# EAGLE schematic c65Keyb (EAGLE 7.1.0)

## Sheet 1 of 2
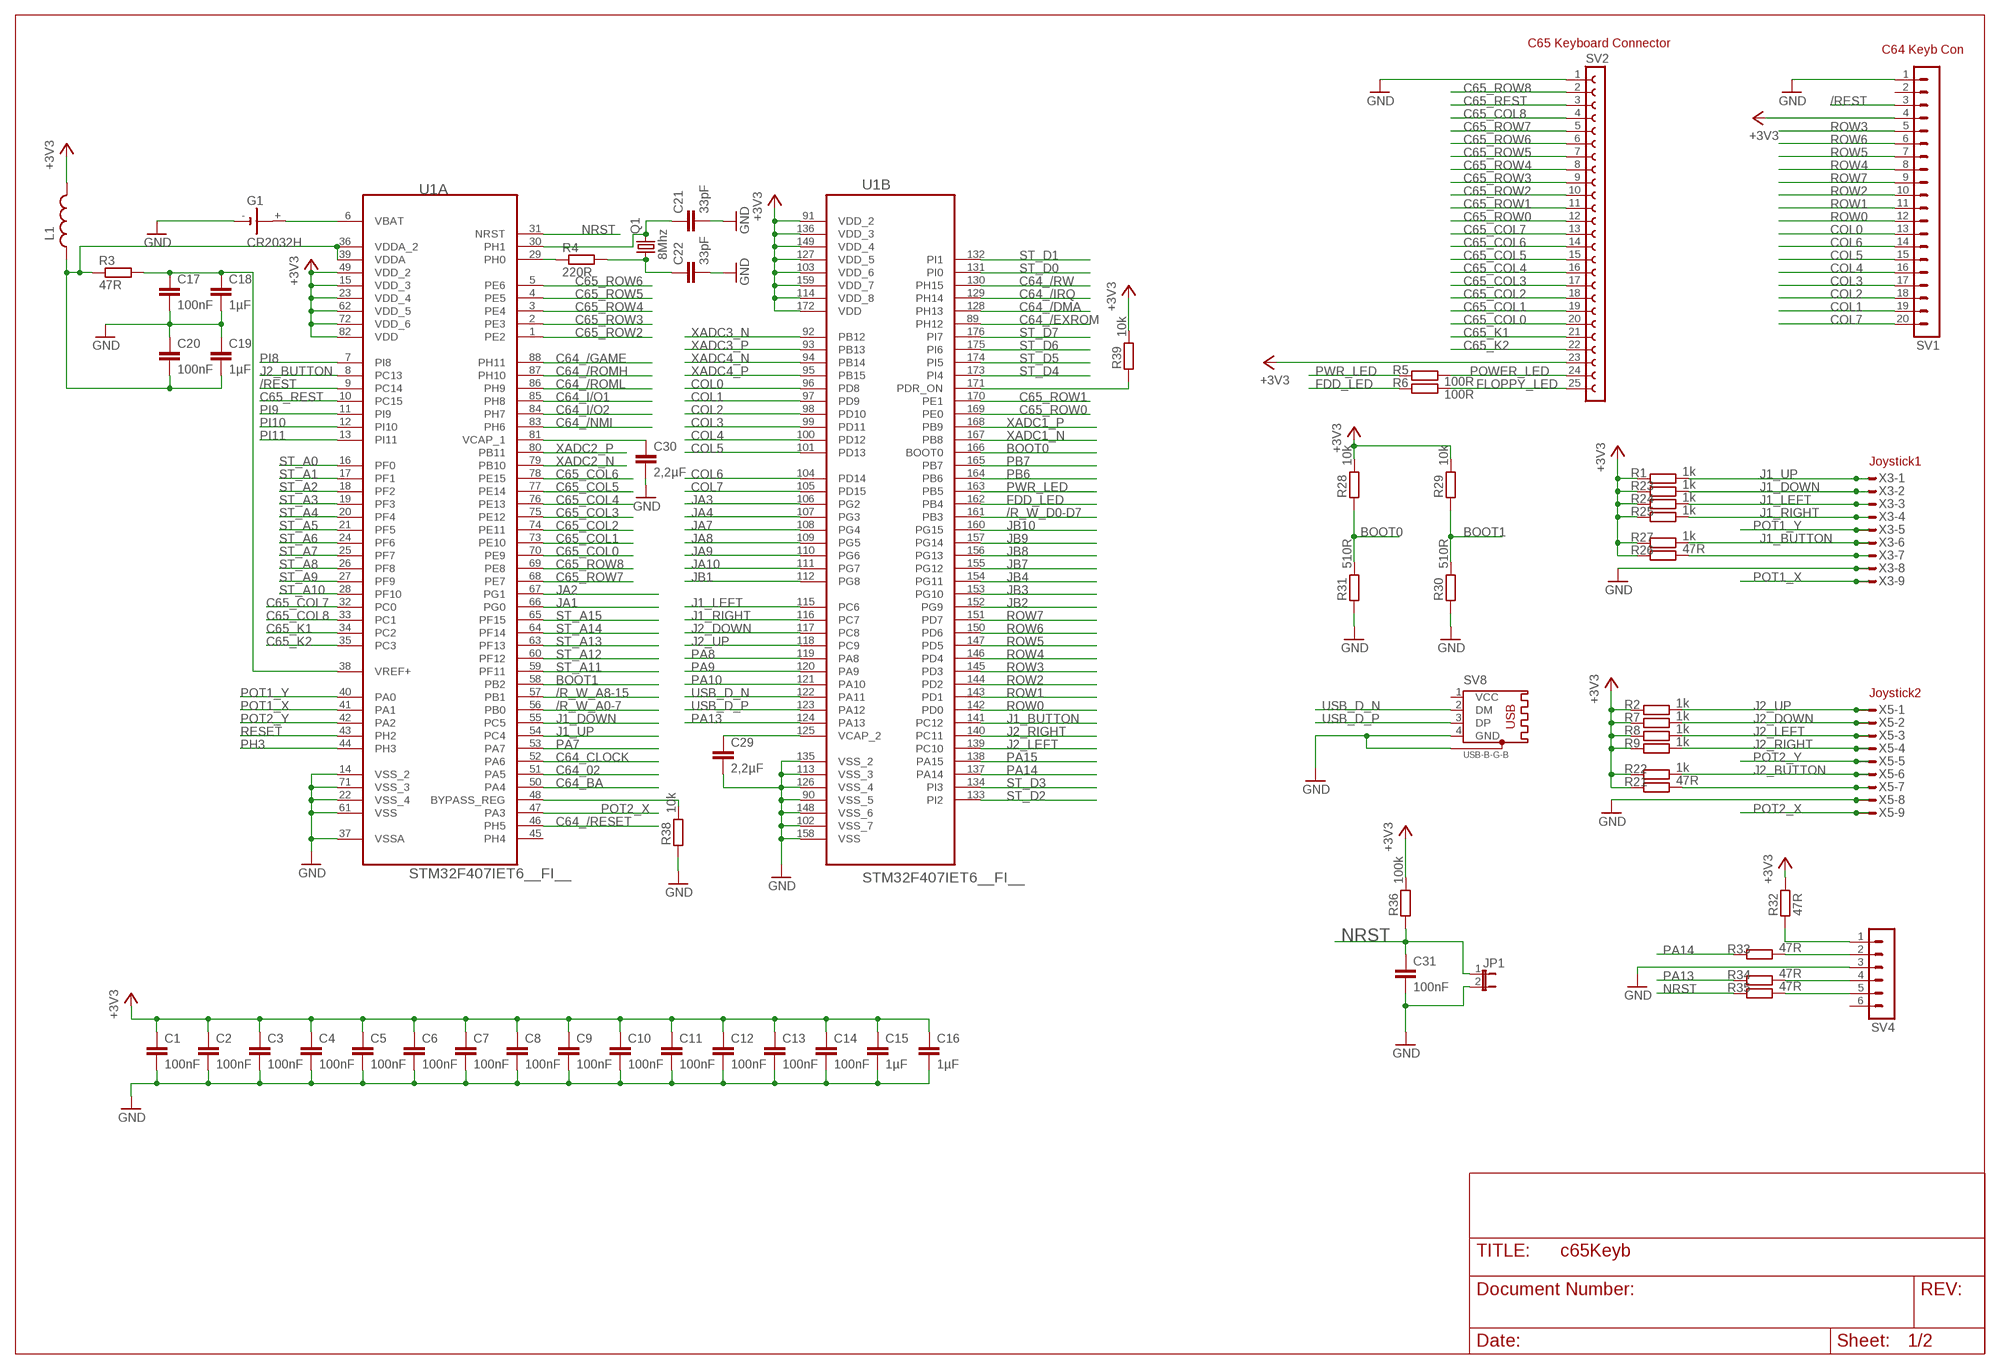
[diagram p0: schematic, sheet 1]

### Parts
C1  100nF  C-EUC0805  [C0805]
C2  100nF  C-EUC0805  [C0805]
C3  100nF  C-EUC0805  [C0805]
C4  100nF  C-EUC0805  [C0805]
C5  100nF  C-EUC0805  [C0805]
C6  100nF  C-EUC0805  [C0805]
C7  100nF  C-EUC0805  [C0805]
C8  100nF  C-EUC0805  [C0805]
C9  100nF  C-EUC0805  [C0805]
C10  100nF  C-EUC0805  [C0805]
C11  100nF  C-EUC0805  [C0805]
C12  100nF  C-EUC0805  [C0805]
C13  100nF  C-EUC0805  [C0805]
C14  100nF  C-EUC0805  [C0805]
C15  1µF  C-EUC0805  [C0805]
C16  1µF  C-EUC0805  [C0805]
C17  100nF  C-EUC0805  [C0805]
C18  1µF  C-EUC0805  [C0805]
C19  1µF  C-EUC0805  [C0805]
C20  100nF  C-EUC0805  [C0805]
C21  33pF  C-EUC0805  [C0805]
C22  33pF  C-EUC0805  [C0805]
C29  2,2µF  C-EUC0805  [C0805]
C30  2,2µF  C-EUC0805  [C0805]
C31  100nF  C-EUC0805  [C0805]
G1  CR2032H  [CR2032H]
JP1  JP1E  [JP1]
L1  L-0805A  [SMD0805-ALT]
Q1  8Mhz  CRYSTAL-HC49UP  [HC49UP]
R1  1k  R-EU_R0805  [R0805]
R2  1k  R-EU_R0805  [R0805]
R3  47R  R-EU_R0805  [R0805]
R4  220R  R-EU_R0805  [R0805]
R5  100R  R-EU_R0805  [R0805]
R6  100R  R-EU_R0805  [R0805]
R7  1k  R-EU_R0805  [R0805]
R8  1k  R-EU_R0805  [R0805]
R9  1k  R-EU_R0805  [R0805]
R21  47R  R-EU_R0805  [R0805]
R22  1k  R-EU_R0805  [R0805]
R23  1k  R-EU_R0805  [R0805]
R24  1k  R-EU_R0805  [R0805]
R25  1k  R-EU_R0805  [R0805]
R26  47R  R-EU_R0805  [R0805]
R27  1k  R-EU_R0805  [R0805]
R28  10k  R-EU_R0805  [R0805]
R29  10k  R-EU_R0805  [R0805]
R30  510R  R-EU_R0805  [R0805]
R31  510R  R-EU_R0805  [R0805]
R32  47R  R-EU_R0805  [R0805]
R33  47R  R-EU_R0805  [R0805]
R34  47R  R-EU_R0805  [R0805]
R35  47R  R-EU_R0805  [R0805]
R36  100k  R-EU_R0805  [R0805]
R38  10k  R-EU_R0805  [R0805]
R39  10k  R-EU_R0805  [R0805]
SV1  MA20-1  [MA20-1]
SV2  C65_MOLEX_KEYB  [C65_MOLEX_KEYB]
SV4  MA06-1  [MA06-1]
SV8  USB-B-G-B  [USB-B-THG-01]
U1  STM32F407IET6__FI__  [QFP176]
X3  M09-182S  [182-009-MALE]
X5  M09-182S  [182-009-MALE]

### Nets
+3V3: C1.1 C2.1 C3.1 C4.1 C5.1 C6.1 C7.1 C8.1 C9.1 C10.1 C11.1 C12.1 C13.1 C14.1 C15.1 C16.1 L1.2 R1.1 R2.1 R7.1 R8.1 R9.1 R21.1 R22.1 R23.1 R24.1 R25.1 R26.1 R27.1 R28.2 R29.2 R32.2 R36.2 R39.2 SV1.4 SV2.23 U1.15(A:VDD_3) U1.23(A:VDD_4) U1.49(A:VDD_2) U1.62(A:VDD_5) U1.72(A:VDD_6) U1.82(A:VDD) U1.91(B:VDD_2) U1.103(B:VDD_6) U1.114(B:VDD_8) U1.127(B:VDD_5) U1.136(B:VDD_3) U1.149(B:VDD_4) U1.159(B:VDD_7) U1.172(B:VDD) ; also sheet 2
/R_W_A0-7: U1.56(A:PB0) ; also sheet 2
/R_W_A8-15: U1.57(A:PB1) ; also sheet 2
/R_W_D0-D7: U1.161(B:PB3) ; also sheet 2
/REST: SV1.3 U1.9(A:PC14)
BOOT0: R28.1 R31.2 U1.166(B:BOOT0)
BOOT1: R29.1 R30.2 U1.58(A:PB2)
C64_02: U1.51(A:PA5) ; also sheet 2
C64_/DMA: U1.128(B:PH13) ; also sheet 2
C64_/EXROM: U1.89(B:PH12) ; also sheet 2
C64_/GAME: U1.88(A:PH11) ; also sheet 2
C64_/IRQ: U1.129(B:PH14) ; also sheet 2
C64_/NMI: U1.83(A:PH6) ; also sheet 2
C64_/RESET: U1.46(A:PH5) ; also sheet 2
C64_/ROMH: U1.87(A:PH10) ; also sheet 2
C64_/ROML: U1.86(A:PH9) ; also sheet 2
C64_/RW: U1.130(B:PH15) ; also sheet 2
C64_BA: U1.50(A:PA4) ; also sheet 2
C64_CLOCK: U1.52(A:PA6) ; also sheet 2
C64_I/O1: U1.85(A:PH8) ; also sheet 2
C64_I/O2: U1.84(A:PH7) ; also sheet 2
C65_COL0: SV2.20 U1.70(A:PE9)
C65_COL1: SV2.19 U1.73(A:PE10)
C65_COL2: SV2.18 U1.74(A:PE11)
C65_COL3: SV2.17 U1.75(A:PE12)
C65_COL4: SV2.16 U1.76(A:PE13)
C65_COL5: SV2.15 U1.77(A:PE14)
C65_COL6: SV2.14 U1.78(A:PE15)
C65_COL7: SV2.13 U1.32(A:PC0)
C65_COL8: SV2.4 U1.33(A:PC1)
C65_K1: SV2.21 U1.34(A:PC2)
C65_K2: SV2.22 U1.35(A:PC3)
C65_REST: SV2.3 U1.10(A:PC15)
C65_ROW0: SV2.12 U1.169(B:PE0)
C65_ROW1: SV2.11 U1.170(B:PE1)
C65_ROW2: SV2.10 U1.1(A:PE2)
C65_ROW3: SV2.9 U1.2(A:PE3)
C65_ROW4: SV2.8 U1.3(A:PE4)
C65_ROW5: SV2.7 U1.4(A:PE5)
C65_ROW6: SV2.6 U1.5(A:PE6)
C65_ROW7: SV2.5 U1.68(A:PE7)
C65_ROW8: SV2.2 U1.69(A:PE8)
COL0: SV1.13 U1.96(B:PD8)
COL1: SV1.19 U1.97(B:PD9)
COL2: SV1.18 U1.98(B:PD10)
COL3: SV1.17 U1.99(B:PD11)
COL4: SV1.16 U1.100(B:PD12)
COL5: SV1.15 U1.101(B:PD13)
COL6: SV1.14 U1.104(B:PD14)
COL7: SV1.20 U1.105(B:PD15)
FDD_LED: R6.1 U1.162(B:PB4)
FLOPPY_LED: R6.2 SV2.25
GND: C1.2 C2.2 C3.2 C4.2 C5.2 C6.2 C7.2 C8.2 C9.2 C10.2 C11.2 C12.2 C13.2 C14.2 C15.2 C16.2 C17.2 C18.2 C19.1 C20.1 C21.2 C22.2 C29.2 C30.2 C31.2 G1.- JP1.2 R30.1 R31.1 R38.1 SV1.1 SV2.1 SV4.3 SV8.4(GND) SV8.G1 U1.14(A:VSS_2) U1.22(A:VSS_4) U1.37(A:VSSA) U1.61(A:VSS) U1.71(A:VSS_3) U1.90(B:VSS_5) U1.102(B:VSS_7) U1.113(B:VSS_3) U1.126(B:VSS_4) U1.135(B:VSS_2) U1.148(B:VSS_6) U1.158(B:VSS) X3.8 X5.8 ; also sheet 2
J1_BUTTON: R27.2 U1.141(B:PC12) X3.6
J1_DOWN: R23.2 U1.55(A:PC5) X3.2
J1_LEFT: R24.2 U1.115(B:PC6) X3.3
J1_RIGHT: R25.2 U1.116(B:PC7) X3.4
J1_UP: R1.2 U1.54(A:PC4) X3.1
J2_BUTTON: R22.2 U1.8(A:PC13) X5.6
J2_DOWN: R7.2 U1.117(B:PC8) X5.2
J2_LEFT: R8.2 U1.139(B:PC10) X5.3
J2_RIGHT: R9.2 U1.140(B:PC11) X5.4
J2_UP: R2.2 U1.118(B:PC9) X5.1
JA1: U1.66(A:PG0) ; also sheet 2
JA2: U1.67(A:PG1) ; also sheet 2
JA3: U1.106(B:PG2) ; also sheet 2
JA4: U1.107(B:PG3) ; also sheet 2
JA7: U1.108(B:PG4) ; also sheet 2
JA8: U1.109(B:PG5) ; also sheet 2
JA9: U1.110(B:PG6) ; also sheet 2
JA10: U1.111(B:PG7) ; also sheet 2
JB1: U1.112(B:PG8) ; also sheet 2
JB2: U1.152(B:PG9) ; also sheet 2
JB3: U1.153(B:PG10) ; also sheet 2
JB4: U1.154(B:PG11) ; also sheet 2
JB7: U1.155(B:PG12) ; also sheet 2
JB8: U1.156(B:PG13) ; also sheet 2
JB9: U1.157(B:PG14) ; also sheet 2
JB10: U1.160(B:PG15) ; also sheet 2
N$1: G1.+ U1.6(A:VBAT)
N$2: R4.1 U1.29(A:PH0)
N$3: C17.1 C18.1 R3.2 U1.38(A:VREF+)
N$4: R21.2 X5.7
N$5: C30.1 U1.81(A:VCAP_1)
N$6: C29.1 U1.125(B:VCAP_2)
N$7: R32.1 SV4.1
N$8: R33.2 SV4.2
N$9: R34.2 SV4.4
N$10: R26.2 X3.7
N$11: R35.2 SV4.5
N$13: R38.2 U1.48(A:BYPASS_REG)
N$14: C21.1 Q1.2 U1.30(A:PH1)
N$15: C22.1 Q1.1 R4.2
N$16: R39.1 U1.171(B:PDR_ON)
N$17: C19.2 C20.2 L1.1 R3.1 U1.36(A:VDDA_2) U1.39(A:VDDA)
NRST: C31.1 JP1.1 R35.1 R36.1 U1.31(A:NRST)
PA7: U1.53(A:PA7) ; also sheet 2
PA8: U1.119(B:PA8) ; also sheet 2
PA9: U1.120(B:PA9) ; also sheet 2
PA10: U1.121(B:PA10) ; also sheet 2
PA13: R34.1 U1.124(B:PA13)
PA14: R33.1 U1.137(B:PA14)
PA15: U1.138(B:PA15) ; also sheet 2
PB6: U1.164(B:PB6) ; also sheet 2
PB7: U1.165(B:PB7) ; also sheet 2
PH3: U1.44(A:PH3) ; also sheet 2
PI8: U1.7(A:PI8) ; also sheet 2
PI9: U1.11(A:PI9) ; also sheet 2
PI10: U1.12(A:PI10) ; also sheet 2
PI11: U1.13(A:PI11) ; also sheet 2
POT1_X: U1.41(A:PA1) X3.9
POT1_Y: U1.40(A:PA0) X3.5
POT2_X: U1.47(A:PA3) X5.9
POT2_Y: U1.42(A:PA2) X5.5
POWER_LED: R5.2 SV2.24
PWR_LED: R5.1 U1.163(B:PB5)
RESET: U1.43(A:PH2) ; also sheet 2
ROW0: SV1.12 U1.142(B:PD0)
ROW1: SV1.11 U1.143(B:PD1)
ROW2: SV1.10 U1.144(B:PD2)
ROW3: SV1.5 U1.145(B:PD3)
ROW4: SV1.8 U1.146(B:PD4)
ROW5: SV1.7 U1.147(B:PD5)
ROW6: SV1.6 U1.150(B:PD6)
ROW7: SV1.9 U1.151(B:PD7)
ST_A0: U1.16(A:PF0) ; also sheet 2
ST_A1: U1.17(A:PF1) ; also sheet 2
ST_A2: U1.18(A:PF2) ; also sheet 2
ST_A3: U1.19(A:PF3) ; also sheet 2
ST_A4: U1.20(A:PF4) ; also sheet 2
ST_A5: U1.21(A:PF5) ; also sheet 2
ST_A6: U1.24(A:PF6) ; also sheet 2
ST_A7: U1.25(A:PF7) ; also sheet 2
ST_A8: U1.26(A:PF8) ; also sheet 2
ST_A9: U1.27(A:PF9) ; also sheet 2
ST_A10: U1.28(A:PF10) ; also sheet 2
ST_A11: U1.59(A:PF11) ; also sheet 2
ST_A12: U1.60(A:PF12) ; also sheet 2
ST_A13: U1.63(A:PF13) ; also sheet 2
ST_A14: U1.64(A:PF14) ; also sheet 2
ST_A15: U1.65(A:PF15) ; also sheet 2
ST_D0: U1.131(B:PI0) ; also sheet 2
ST_D1: U1.132(B:PI1) ; also sheet 2
ST_D2: U1.133(B:PI2) ; also sheet 2
ST_D3: U1.134(B:PI3) ; also sheet 2
ST_D4: U1.173(B:PI4) ; also sheet 2
ST_D5: U1.174(B:PI5) ; also sheet 2
ST_D6: U1.175(B:PI6) ; also sheet 2
ST_D7: U1.176(B:PI7) ; also sheet 2
USB_D_N: SV8.2(DM) U1.122(B:PA11)
USB_D_P: SV8.3(DP) U1.123(B:PA12)
XADC1_N: U1.167(B:PB8) ; also sheet 2
XADC1_P: U1.168(B:PB9) ; also sheet 2
XADC2_N: U1.79(A:PB10) ; also sheet 2
XADC2_P: U1.80(A:PB11) ; also sheet 2
XADC3_N: U1.92(B:PB12) ; also sheet 2
XADC3_P: U1.93(B:PB13) ; also sheet 2
XADC4_N: U1.94(B:PB14) ; also sheet 2
XADC4_P: U1.95(B:PB15) ; also sheet 2
Unconnected: G1.+@1(+) SV1.2 SV4.6 SV8.1(VCC) SV8.G2 U1.45(A:PH4)

### Notes on the sheet
- C65 Keyboard Connector
- C64 Keyb Con
- Joystick1
- Joystick2

## Sheet 2 of 2
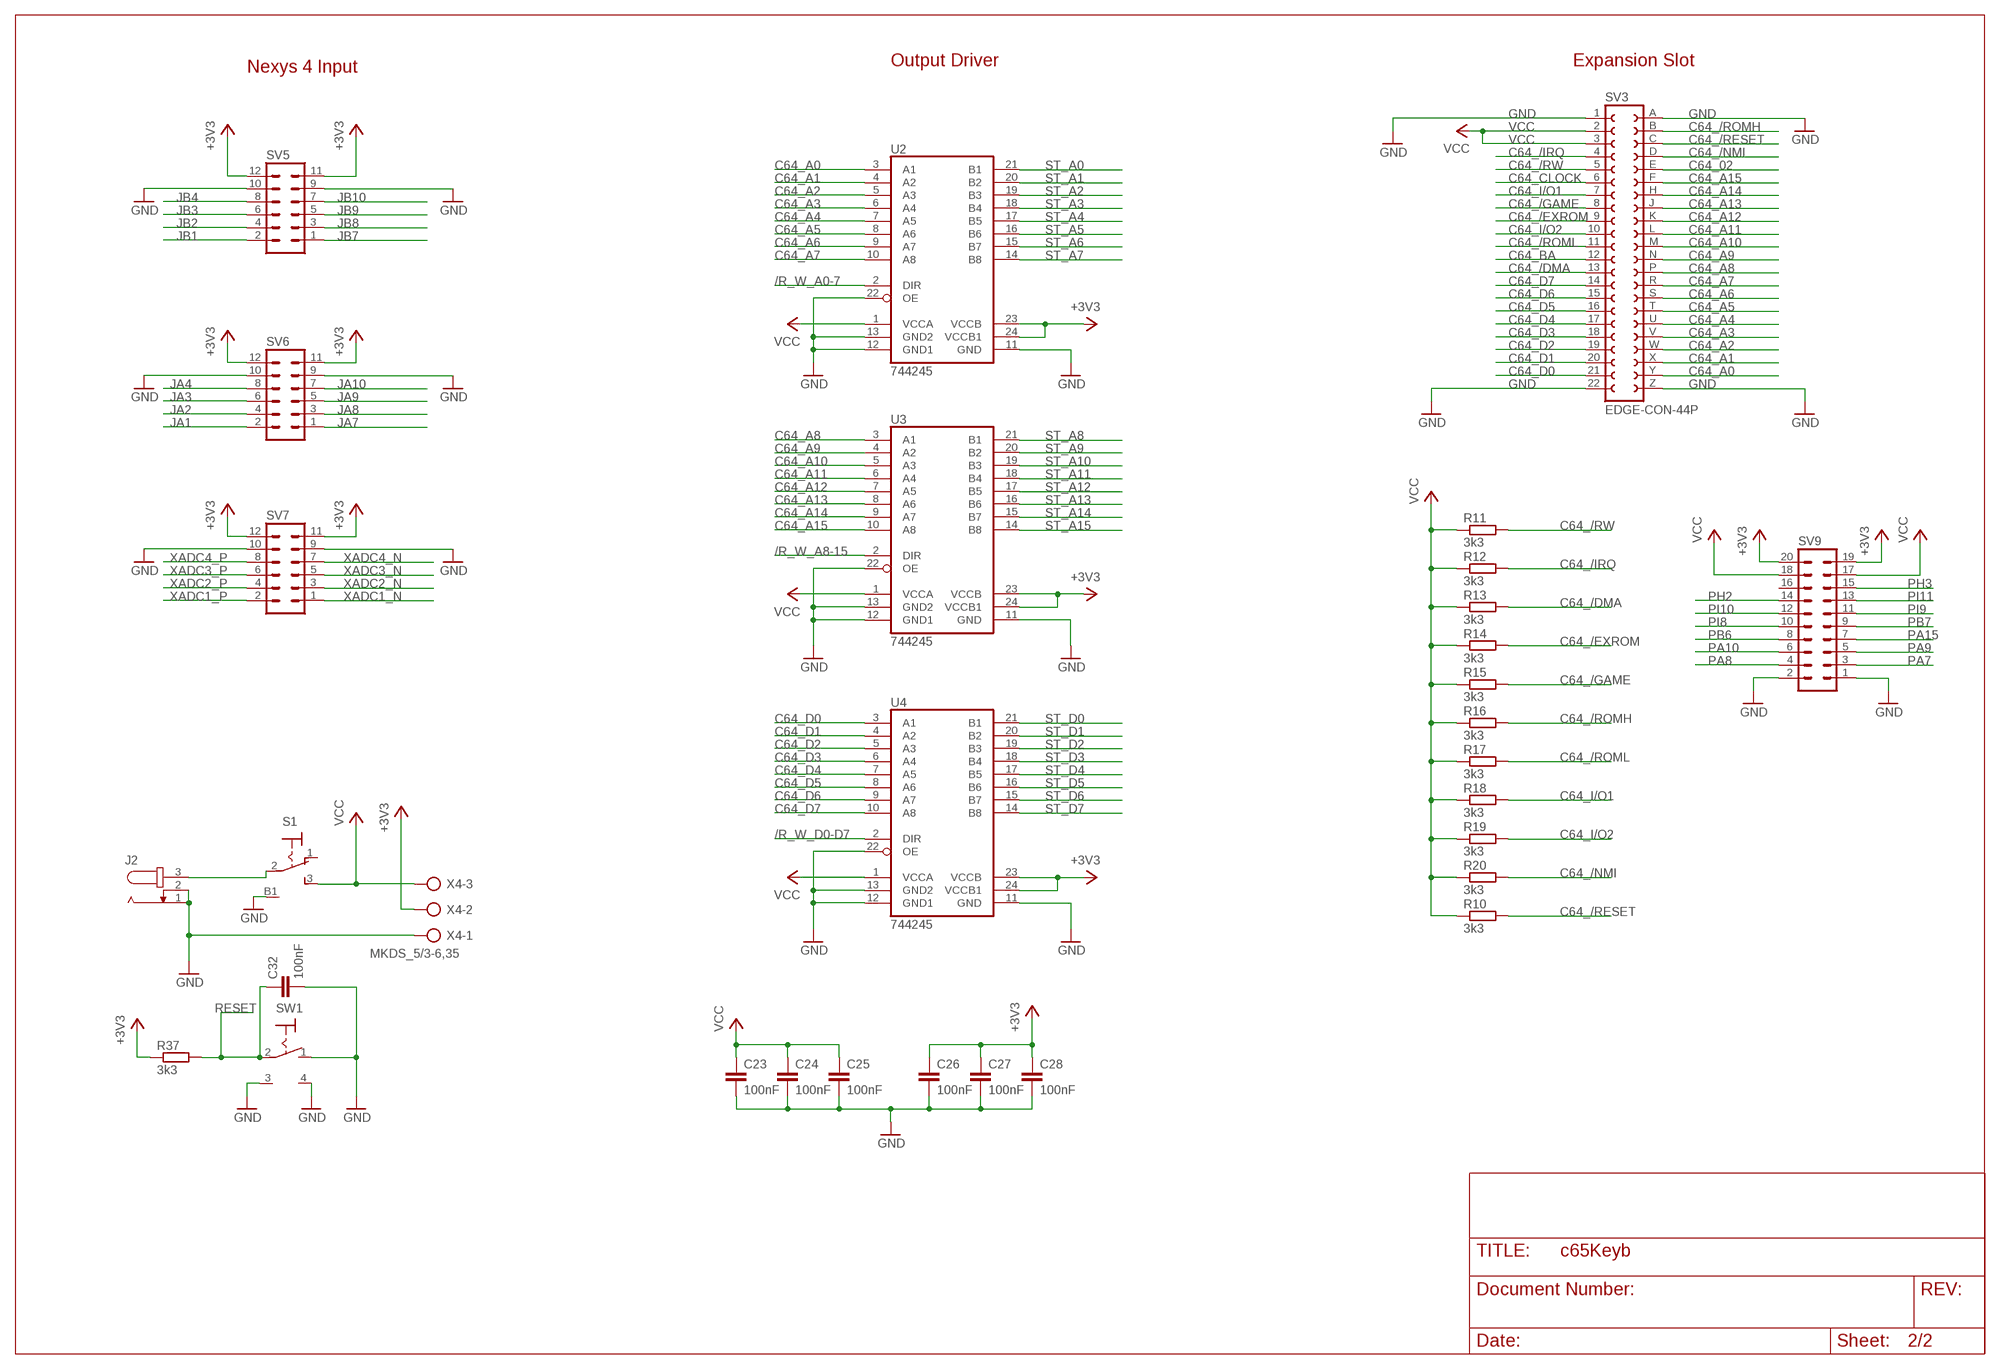
[diagram p1: schematic, sheet 2]

### Parts
C23  100nF  C-EUC0805  [C0805]
C24  100nF  C-EUC0805  [C0805]
C25  100nF  C-EUC0805  [C0805]
C26  100nF  C-EUC0805  [C0805]
C27  100nF  C-EUC0805  [C0805]
C28  100nF  C-EUC0805  [C0805]
C32  100nF  C-EUC0805  [C0805]
J2  JACK-PLUG1  [SPC4078]
R10  3k3  R-EU_R0805  [R0805]
R11  3k3  R-EU_R0805  [R0805]
R12  3k3  R-EU_R0805  [R0805]
R13  3k3  R-EU_R0805  [R0805]
R14  3k3  R-EU_R0805  [R0805]
R15  3k3  R-EU_R0805  [R0805]
R16  3k3  R-EU_R0805  [R0805]
R17  3k3  R-EU_R0805  [R0805]
R18  3k3  R-EU_R0805  [R0805]
R19  3k3  R-EU_R0805  [R0805]
R20  3k3  R-EU_R0805  [R0805]
R37  3k3  R-EU_R0805  [R0805]
S1  LPV-1  [LPV-1]
SV3  EDGE-CON-44P  [EDGE-CON-44]
SV5  MA06-2W  [MA06-2W]
SV6  MA06-2W  [MA06-2W]
SV7  MA06-2W  [MA06-2W]
SV9  MA10-2  [MA10-2]
SW1  TASTER  [MICRO_SWITCH]
U2  744245  [SO24L]
U3  744245  [SO24L]
U4  744245  [SO24L]
X4  MKDS_5/3-6,35  [MKDS_5/3-635]

### Nets
+3V3: C26.1 C27.1 C28.1 R37.1 SV5.11 SV5.12 SV6.11 SV6.12 SV7.11 SV7.12 SV9.19 SV9.20 U2.23(VCCB) U2.24(VCCB1) U3.23(VCCB) U3.24(VCCB1) U4.23(VCCB) U4.24(VCCB1) X4.2 ; also sheet 1
/R_W_A0-7: U2.2(DIR) ; also sheet 1
/R_W_A8-15: U3.2(DIR) ; also sheet 1
/R_W_D0-D7: U4.2(DIR) ; also sheet 1
C64_02: SV3.E ; also sheet 1
C64_/DMA: R13.2 SV3.13 ; also sheet 1
C64_/EXROM: R14.2 SV3.9 ; also sheet 1
C64_/GAME: R15.2 SV3.8 ; also sheet 1
C64_/IRQ: R12.2 SV3.4 ; also sheet 1
C64_/NMI: R20.2 SV3.D ; also sheet 1
C64_/RESET: R10.2 SV3.C ; also sheet 1
C64_/ROMH: R16.2 SV3.B ; also sheet 1
C64_/ROML: R17.2 SV3.11 ; also sheet 1
C64_/RW: R11.2 SV3.5 ; also sheet 1
C64_A0: SV3.Y U2.3(A1)
C64_A1: SV3.X U2.4(A2)
C64_A2: SV3.W U2.5(A3)
C64_A3: SV3.V U2.6(A4)
C64_A4: SV3.U U2.7(A5)
C64_A5: SV3.T U2.8(A6)
C64_A6: SV3.S U2.9(A7)
C64_A7: SV3.R U2.10(A8)
C64_A8: SV3.P U3.3(A1)
C64_A9: SV3.N U3.4(A2)
C64_A10: SV3.M U3.5(A3)
C64_A11: SV3.L U3.6(A4)
C64_A12: SV3.K U3.7(A5)
C64_A13: SV3.J U3.8(A6)
C64_A14: SV3.H U3.9(A7)
C64_A15: SV3.F U3.10(A8)
C64_BA: SV3.12 ; also sheet 1
C64_CLOCK: SV3.6 ; also sheet 1
C64_D0: SV3.21 U4.3(A1)
C64_D1: SV3.20 U4.4(A2)
C64_D2: SV3.19 U4.5(A3)
C64_D3: SV3.18 U4.6(A4)
C64_D4: SV3.17 U4.7(A5)
C64_D5: SV3.16 U4.8(A6)
C64_D6: SV3.15 U4.9(A7)
C64_D7: SV3.14 U4.10(A8)
C64_I/O1: R18.2 SV3.7 ; also sheet 1
C64_I/O2: R19.2 SV3.10 ; also sheet 1
GND: C23.2 C24.2 C25.2 C26.2 C27.2 C28.2 C32.2 J2.1 J2.2 S1.B1(B) SV3.1 SV3.22 SV3.A SV3.Z SV5.9 SV5.10 SV6.9 SV6.10 SV7.9 SV7.10 SV9.1 SV9.2 SW1.1(O) SW1.3(B) SW1.4(B1) U2.11(GND) U2.12(GND1) U2.13(GND2) U2.22(OE) U3.11(GND) U3.12(GND1) U3.13(GND2) U3.22(OE) U4.11(GND) U4.12(GND1) U4.13(GND2) U4.22(OE) X4.1 ; also sheet 1
JA1: SV6.2 ; also sheet 1
JA2: SV6.4 ; also sheet 1
JA3: SV6.6 ; also sheet 1
JA4: SV6.8 ; also sheet 1
JA7: SV6.1 ; also sheet 1
JA8: SV6.3 ; also sheet 1
JA9: SV6.5 ; also sheet 1
JA10: SV6.7 ; also sheet 1
JB1: SV5.2 ; also sheet 1
JB2: SV5.4 ; also sheet 1
JB3: SV5.6 ; also sheet 1
JB4: SV5.8 ; also sheet 1
JB7: SV5.1 ; also sheet 1
JB8: SV5.3 ; also sheet 1
JB9: SV5.5 ; also sheet 1
JB10: SV5.7 ; also sheet 1
N$12: J2.3 S1.2(P)
PA7: SV9.3 ; also sheet 1
PA8: SV9.4 ; also sheet 1
PA9: SV9.5 ; also sheet 1
PA10: SV9.6 ; also sheet 1
PA15: SV9.7 ; also sheet 1
PB6: SV9.8 ; also sheet 1
PB7: SV9.9 ; also sheet 1
PH2: SV9.14
PH3: SV9.15 ; also sheet 1
PI8: SV9.10 ; also sheet 1
PI9: SV9.11 ; also sheet 1
PI10: SV9.12 ; also sheet 1
PI11: SV9.13 ; also sheet 1
RESET: C32.1 R37.2 SW1.2(P) ; also sheet 1
ST_A0: U2.21(B1) ; also sheet 1
ST_A1: U2.20(B2) ; also sheet 1
ST_A2: U2.19(B3) ; also sheet 1
ST_A3: U2.18(B4) ; also sheet 1
ST_A4: U2.17(B5) ; also sheet 1
ST_A5: U2.16(B6) ; also sheet 1
ST_A6: U2.15(B7) ; also sheet 1
ST_A7: U2.14(B8) ; also sheet 1
ST_A8: U3.21(B1) ; also sheet 1
ST_A9: U3.20(B2) ; also sheet 1
ST_A10: U3.19(B3) ; also sheet 1
ST_A11: U3.18(B4) ; also sheet 1
ST_A12: U3.17(B5) ; also sheet 1
ST_A13: U3.16(B6) ; also sheet 1
ST_A14: U3.15(B7) ; also sheet 1
ST_A15: U3.14(B8) ; also sheet 1
ST_D0: U4.21(B1) ; also sheet 1
ST_D1: U4.20(B2) ; also sheet 1
ST_D2: U4.19(B3) ; also sheet 1
ST_D3: U4.18(B4) ; also sheet 1
ST_D4: U4.17(B5) ; also sheet 1
ST_D5: U4.16(B6) ; also sheet 1
ST_D6: U4.15(B7) ; also sheet 1
ST_D7: U4.14(B8) ; also sheet 1
VCC: C23.1 C24.1 C25.1 R10.1 R11.1 R12.1 R13.1 R14.1 R15.1 R16.1 R17.1 R18.1 R19.1 R20.1 S1.3(S) SV3.2 SV3.3 SV9.17 SV9.18 U2.1(VCCA) U3.1(VCCA) U4.1(VCCA) X4.3
XADC1_N: SV7.1 ; also sheet 1
XADC1_P: SV7.2 ; also sheet 1
XADC2_N: SV7.3 ; also sheet 1
XADC2_P: SV7.4 ; also sheet 1
XADC3_N: SV7.5 ; also sheet 1
XADC3_P: SV7.6 ; also sheet 1
XADC4_N: SV7.7 ; also sheet 1
XADC4_P: SV7.8 ; also sheet 1
Unconnected: S1.1(O) SV9.16

### Notes on the sheet
- Output Driver | Expansion Slot
- Nexys 4 Input

## Library data of the parts
C1-C32 = rcl:C-EU: CAPACITOR, European symbol
G1 = battery:CR2032H: LI BATTERY Varta
J2 = con-jack:JACK-PLUG: DC POWER JACK Power Jack, DC, Right Angle, Through Hole, Rated 5A at 16VDC, PC Terminals Distributor: Farnell (www.Farnell.de) Drawing: 84N1161.pdf / 84N1162.pdf Manufacturer: SPC Technology (www.spctechnology.com) Type: SPC4077 / SPC 4078; OC_FARNELL: unknown; OC_NEWARK: unknown
JP1 = jumper:JP1E: JUMPER
L1 = fi-DISCRT:L: Induktivität Kopie von: DISCRETE.lbr (4.11) / L-10.dev (umbenannt) letzte Änderung: 24.04.2006 / UT Änderungen: 24.04.2006 / UT / Packages L-WESD... hinzugefügt SYMBOL: L.sym Kopie von: DISCRETE.lbr (4.11) / INDUCTOR.sym Änderungen: Layer 94 (Symbols) + 93 (Pins): um 90° gedreht Layer 95 (Names): Position Layer 96 (Values): Position
Q1 = fi-CRYSTAL:CRYSTAL: CRYSTAL Packages übrprüfen !
R1-R39 = rcl:R-EU_: RESISTOR, European symbol
S1 = mega65:LPV-1: TOGGLE SWITCH
SV1 = con-lstb:MA20-1: PIN HEADER; OC_FARNELL: unknown; OC_NEWARK: unknown
SV2 = mega65:C65_MOLEX_KEYB
SV3 = mega65:EDGE-CON-44P
SV4 = con-lstb:MA06-1: PIN HEADER; OC_FARNELL: unknown; OC_NEWARK: unknown
SV5-SV7 = mega65:MA06-2W: PIN HEADER
SV8 = fi-CON-PANEL:USB-B-G
SV9 = con-lstb:MA10-2: PIN HEADER; OC_FARNELL: unknown; OC_NEWARK: unknown
SW1 = mega65:TASTER
U1 = fi-IC-DIV:STM32F407IET6: Definition unvollständig/ungeprüft / PAC woher??? IC MCU, 32BIT, 512KB FLASH, 176LQFP JK: von Farnell Site kopiert!
U2-U4 = mega65:744245
X3 X5 = con-subd:M09?S: SUB-D; OC_FARNELL: unknown; OC_NEWARK: unknown
X4 = con-phoenix-mkds_5:MKDS_5/3-: MKDS 5/3-6,35 Source: PHOENIX CONTACT; MF: FARNELL; MPN: 1714968; OC_FARNELL: 3704695; OC_NEWARK: 71C4092